# EAGLE design untitled (EAGLE 7.2.0)
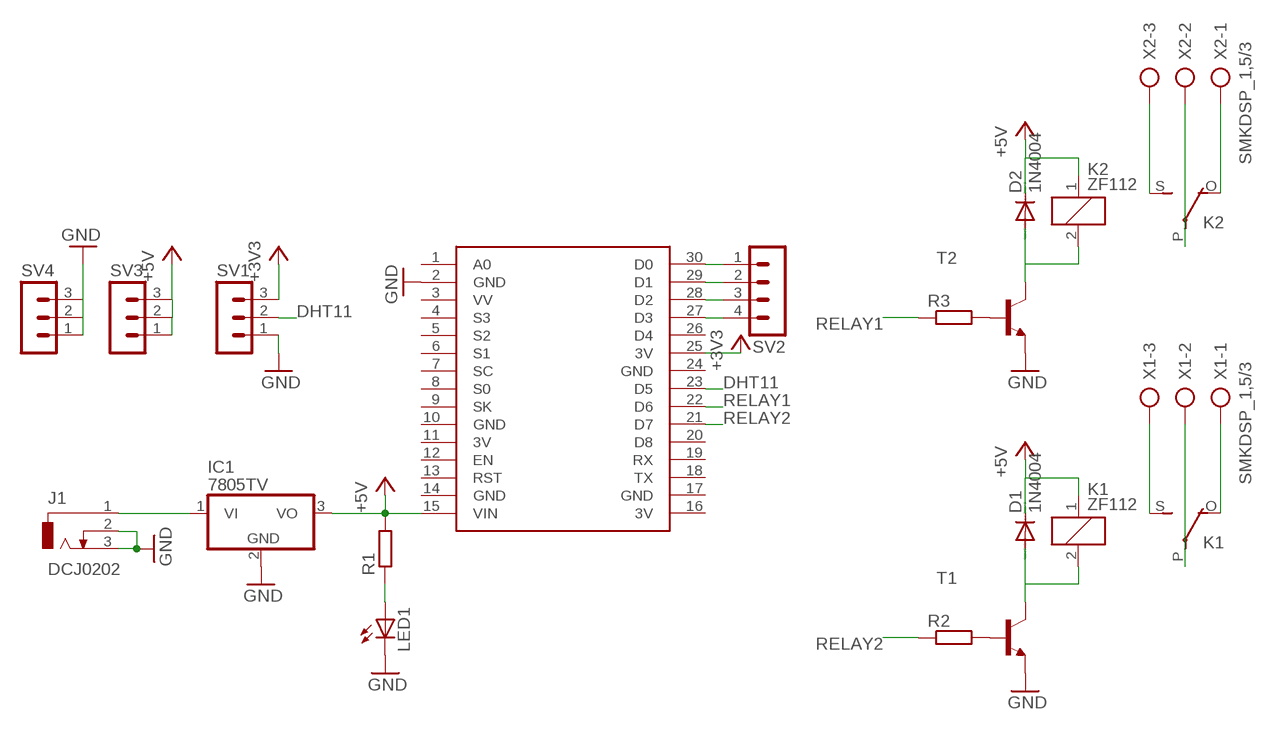
[diagram p0: schematic, sheet 1]

## Parts
D1  1N4004  [DO41-10]
D2  1N4004  [DO41-10]
IC1  7805TV  [TO220V]
J1  DCJ0202  [DCJ0202]
K1  ZF112  [ZF112]
K2  ZF112  [ZF112]
LED1  LED5MM  [LED5MM]
R1  R-EU_0207/10  [0207/10]
R2  R-EU_0207/10  [0207/10]
R3  R-EU_0207/10  [0207/10]
SV1  MA03-1  [MA03-1]
SV2  MA04-1  [MA04-1]
SV3  MA03-1  [MA03-1]
SV4  MA03-1  [MA03-1]
T1  2N2222-NPN-TO18-EBC  [TO18]
T2  2N2222-NPN-TO18-EBC  [TO18]
U$1  NODEMCU  [NODEMCU]
X1  SMKDSP_1,5/3  [SMKDSP_1,5/3]
X2  SMKDSP_1,5/3  [SMKDSP_1,5/3]

## Nets
+3V3: SV1.3 U$1.25(3V)
+5V: D1.C D2.C IC1.3(VO) K1.1 K2.1 R1.2 SV3.1 SV3.2 SV3.3 U$1.15(VIN)
DHT11: SV1.2 U$1.23(D5)
GND: IC1.2(GND) J1.2 J1.3 LED1.K(C) SV1.1 SV4.1 SV4.2 SV4.3 T1.1(E) T2.1(E) U$1.2(GND)
N$1: K1.S(2:S) X1.3
N$2: LED1.A R1.1
N$3: IC1.1(VI) J1.1
N$4: D1.A K1.2 T1.3(C)
N$5: K1.O(2:O) X1.1
N$6: SV2.1 U$1.30(D0)
N$7: SV2.2 U$1.29(D1)
N$8: SV2.3 U$1.28(D2)
N$9: SV2.4 U$1.27(D3)
N$10: K1.P(2:P) X1.2
N$11: R2.2 T1.2(B)
N$12: D2.A K2.2 T2.3(C)
N$13: R3.2 T2.2(B)
N$14: K2.S(2:S) X2.3
N$15: K2.O(2:O) X2.1
N$16: K2.P(2:P) X2.2
RELAY1: R3.1 U$1.22(D6)
RELAY2: R2.1 U$1.21(D7)
Unconnected: U$1.1(A0) U$1.3(VV) U$1.4(S3) U$1.5(S2) U$1.6(S1) U$1.7(SC) U$1.8(S0) U$1.9(SK) U$1.12(EN) U$1.13(RST) U$1.18(TX) U$1.19(RX) U$1.20(D8) U$1.26(D4)

## Power pins joined to a net without a drawn wire
3V: U$1.11(3V) U$1.16(3V)
GND: U$1.10(GND) U$1.14(GND) U$1.17(GND) U$1.24(GND)

## Library data of the parts
D1 D2 = diode:1N4004: DIODE general purpose rectifier, 1 A
IC1 = linear:78*: Positive VOLTAGE REGULATOR Source: http://cache.national.com/ds/LM/LM78L05.pdf http://www.fairchildsemi.com/ds/LM/LM7805.pdf
J1 = con-jack:DCJ0202: DC POWER JACK Source: DCJ0202.pdf; OC_FARNELL: unknown; OC_NEWARK: unknown
K1 K2 = relay:ZF112: RELAY 1 x switch; OC_FARNELL: unknown; OC_NEWARK: unknown
LED1 = led:LED: LED OSRAM: - CHIPLED LG R971, LG N971, LY N971, LG Q971, LY Q971, LO R971, LY R971 LH N974, LH R974 LS Q976, LO Q976, LY Q976 LO Q996 - Hyper CHIPLED LW Q18S LB Q993, LB Q99A, LB R99A - SideLED LS A670, LO A670, LY A670, LG A670, LP A670 LB A673, LV A673, LT A673, LW A673 LH A674 LY A675 LS A676, LA A676, LO A676, LY A676, LW A676 LS A679, LY A679, LG A679 - Hyper Micro SIDELED® LS Y876, LA Y876, LO Y876, LY Y876 LT Y87S - SmartLED LW L88C, LW L88S LB L89C, LB L89S, LG L890 LS L89K, LO L89K, LY L89K LS L896, LA L896, LO L896, LY L896 - TOPLED LS T670, LO T670, LY T670, LG T670, LP T670 LSG T670, LSP T670, LSY T670, LOP T670, LYG T670 LG T671, LOG T671, LSG T671 LB T673, LV T673, LT T673, LW T673 LH T674 LS T676, LA T676, LO T676, LY T676, LB T676, LH T676, LSB T676, LW T676 LB T67C, LV T67C, LT T67C, LS T67K, LO T67K, LY T67K, LW E67C LS E67B, LA E67B, LO E67B, LY E67B, LB E67C, LV E67C, LT E67C LW T67C LS T679, LY T679, LG T679 LS T770, LO T770, LY T770, LG T770, LP T770 LB T773, LV T773, LT T773, LW T773 LH T774 LS E675, LA E675, LY E675, LS T675 LS T776, LA T776, LO T776, LY T776, LB T776 LHGB T686 LT T68C, LB T68C - Hyper Mini TOPLED® LB M676 - Mini TOPLED Santana® LG M470 LS M47K, LO M47K, LY M47K Source: http://www.osram.convergy.de LUXEON: - LUMILED® LXK2-PW12-R00, LXK2-PW12-S00, LXK2-PW14-U00, LXK2-PW14-V00 LXK2-PM12-R00, LXK2-PM12-S00, LXK2-PM14-U00 LXK2-PE12-Q00, LXK2-PE12-R00, LXK2-PE12-S00, LXK2-PE14-T00, LXK2-PE14-U00 LXK2-PB12-K00, LXK2-PB12-L00, LXK2-PB12-M00, LXK2-PB14-N00, LXK2-PB14-P00, LXK2-PB14-Q00 LXK2-PR12-L00, LXK2-PR12-M00, LXK2-PR14-Q00, LXK2-PR14-R00 LXK2-PD12-Q00, LXK2-PD12-R00, LXK2-PD12-S00 LXK2-PH12-R00, LXK2-PH12-S00 LXK2-PL12-P00, LXK2-PL12-Q00, LXK2-PL12-R00 Source: www.luxeon.com KINGBRIGHT: KA-3528ASYC Source: www.kingbright.com
R1-R3 = resistor:R-EU_: RESISTOR, European symbol
SV1 SV3 SV4 = con-lstb:MA03-1: PIN HEADER; OC_FARNELL: unknown; OC_NEWARK: unknown
SV2 = con-lstb:MA04-1: PIN HEADER; OC_FARNELL: unknown; OC_NEWARK: unknown
T1 T2 = transistor:*-NPN-: NPN Transistror BF959 corrected 2008.03.06
U$1 = nodemcu:NODEMCU
X1 X2 = con-phoenix-smkdsp:SMKDSP_1,5/3: Printklemme, Nennstrom: 17,5 A, Bemessungsspannung: 250 V, Raster: 5,0 mm Source: http://eshop.phoenixcontact.de .. 1733415.pdf; MF: FARNELL; MPN: 1733583; OC_FARNELL: 3041256; OC_NEWARK: 71C4130

## Board
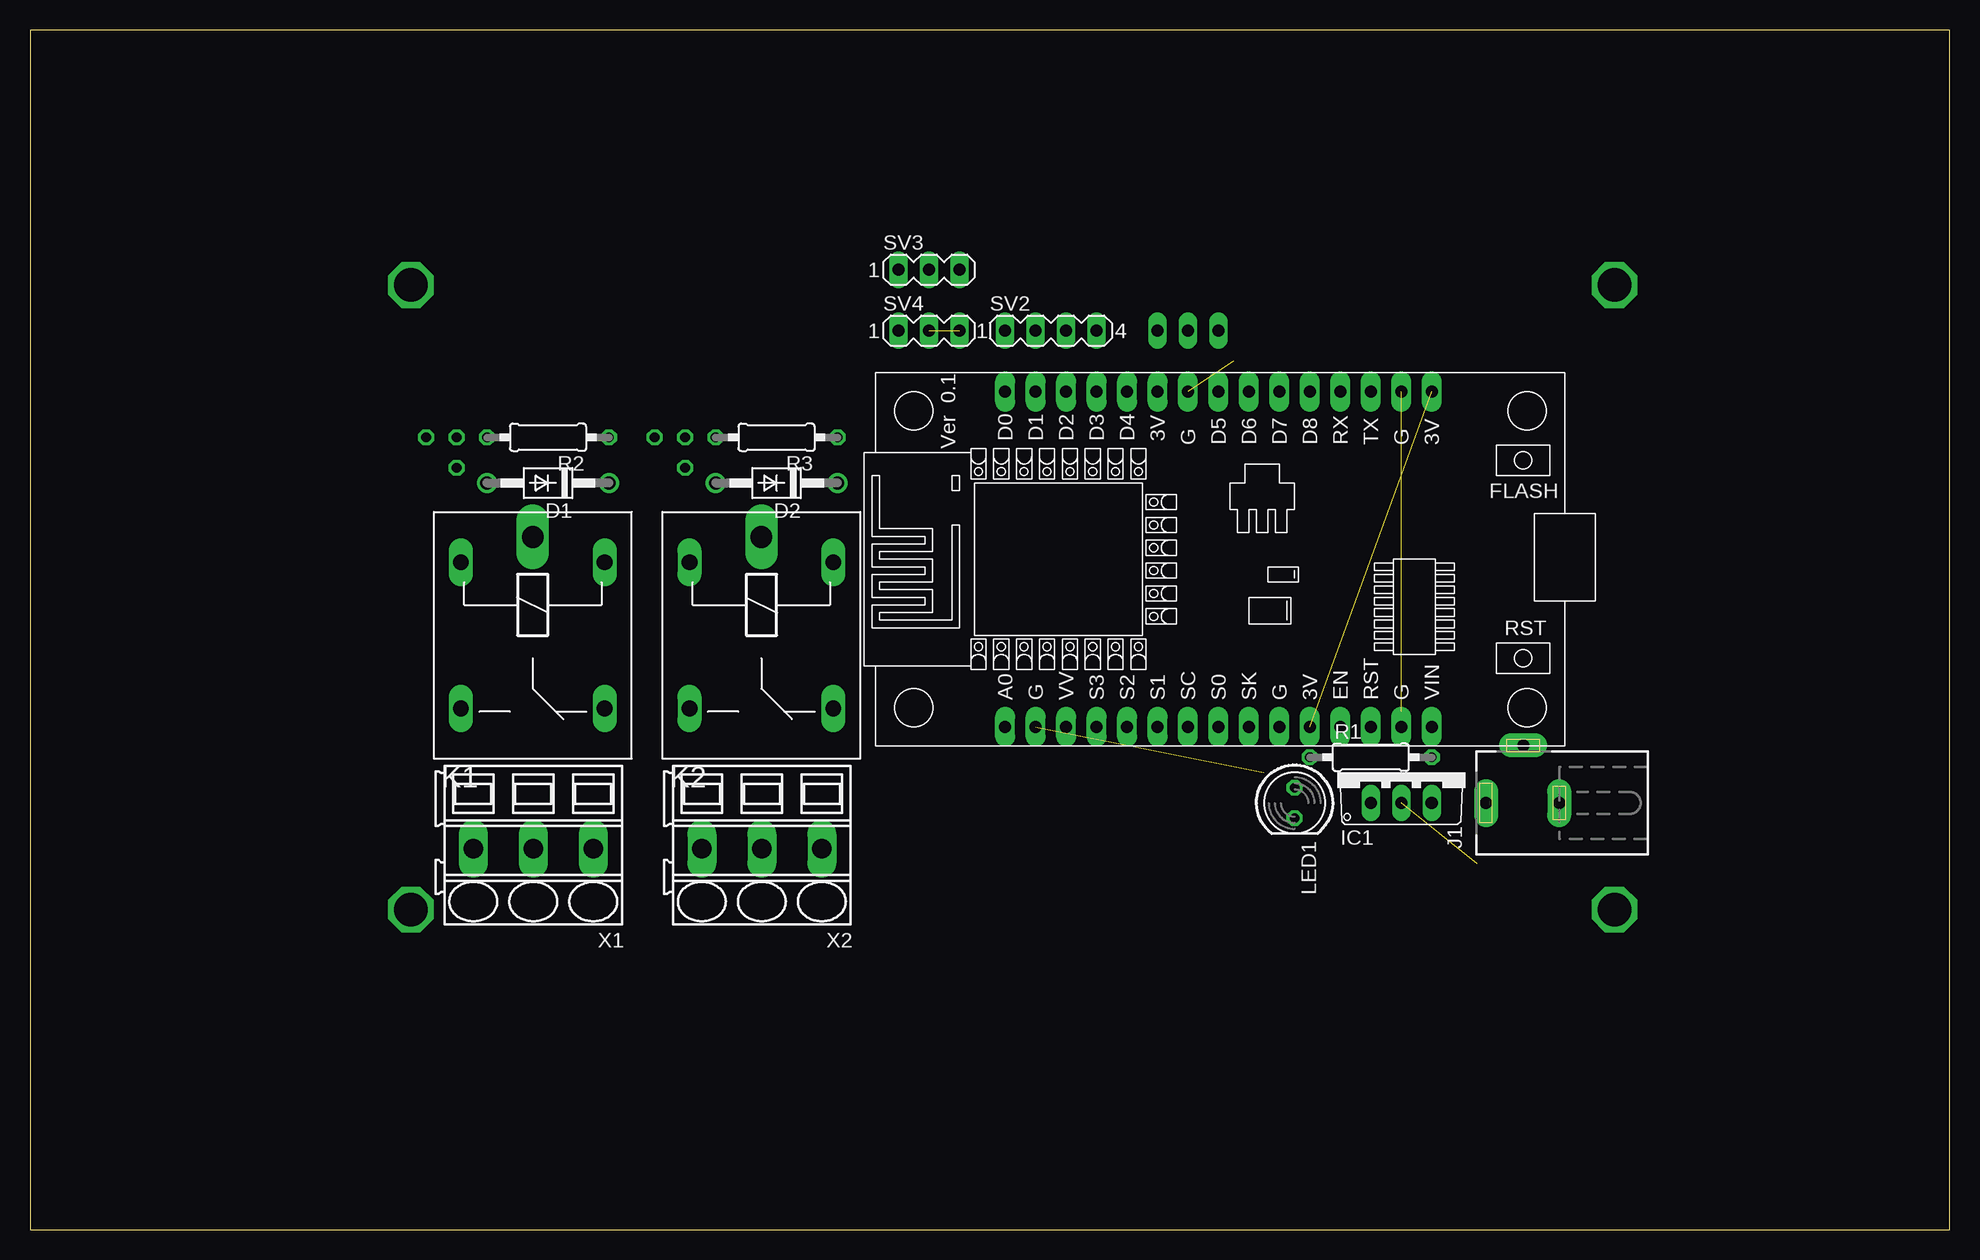
[diagram p1: board, top side]
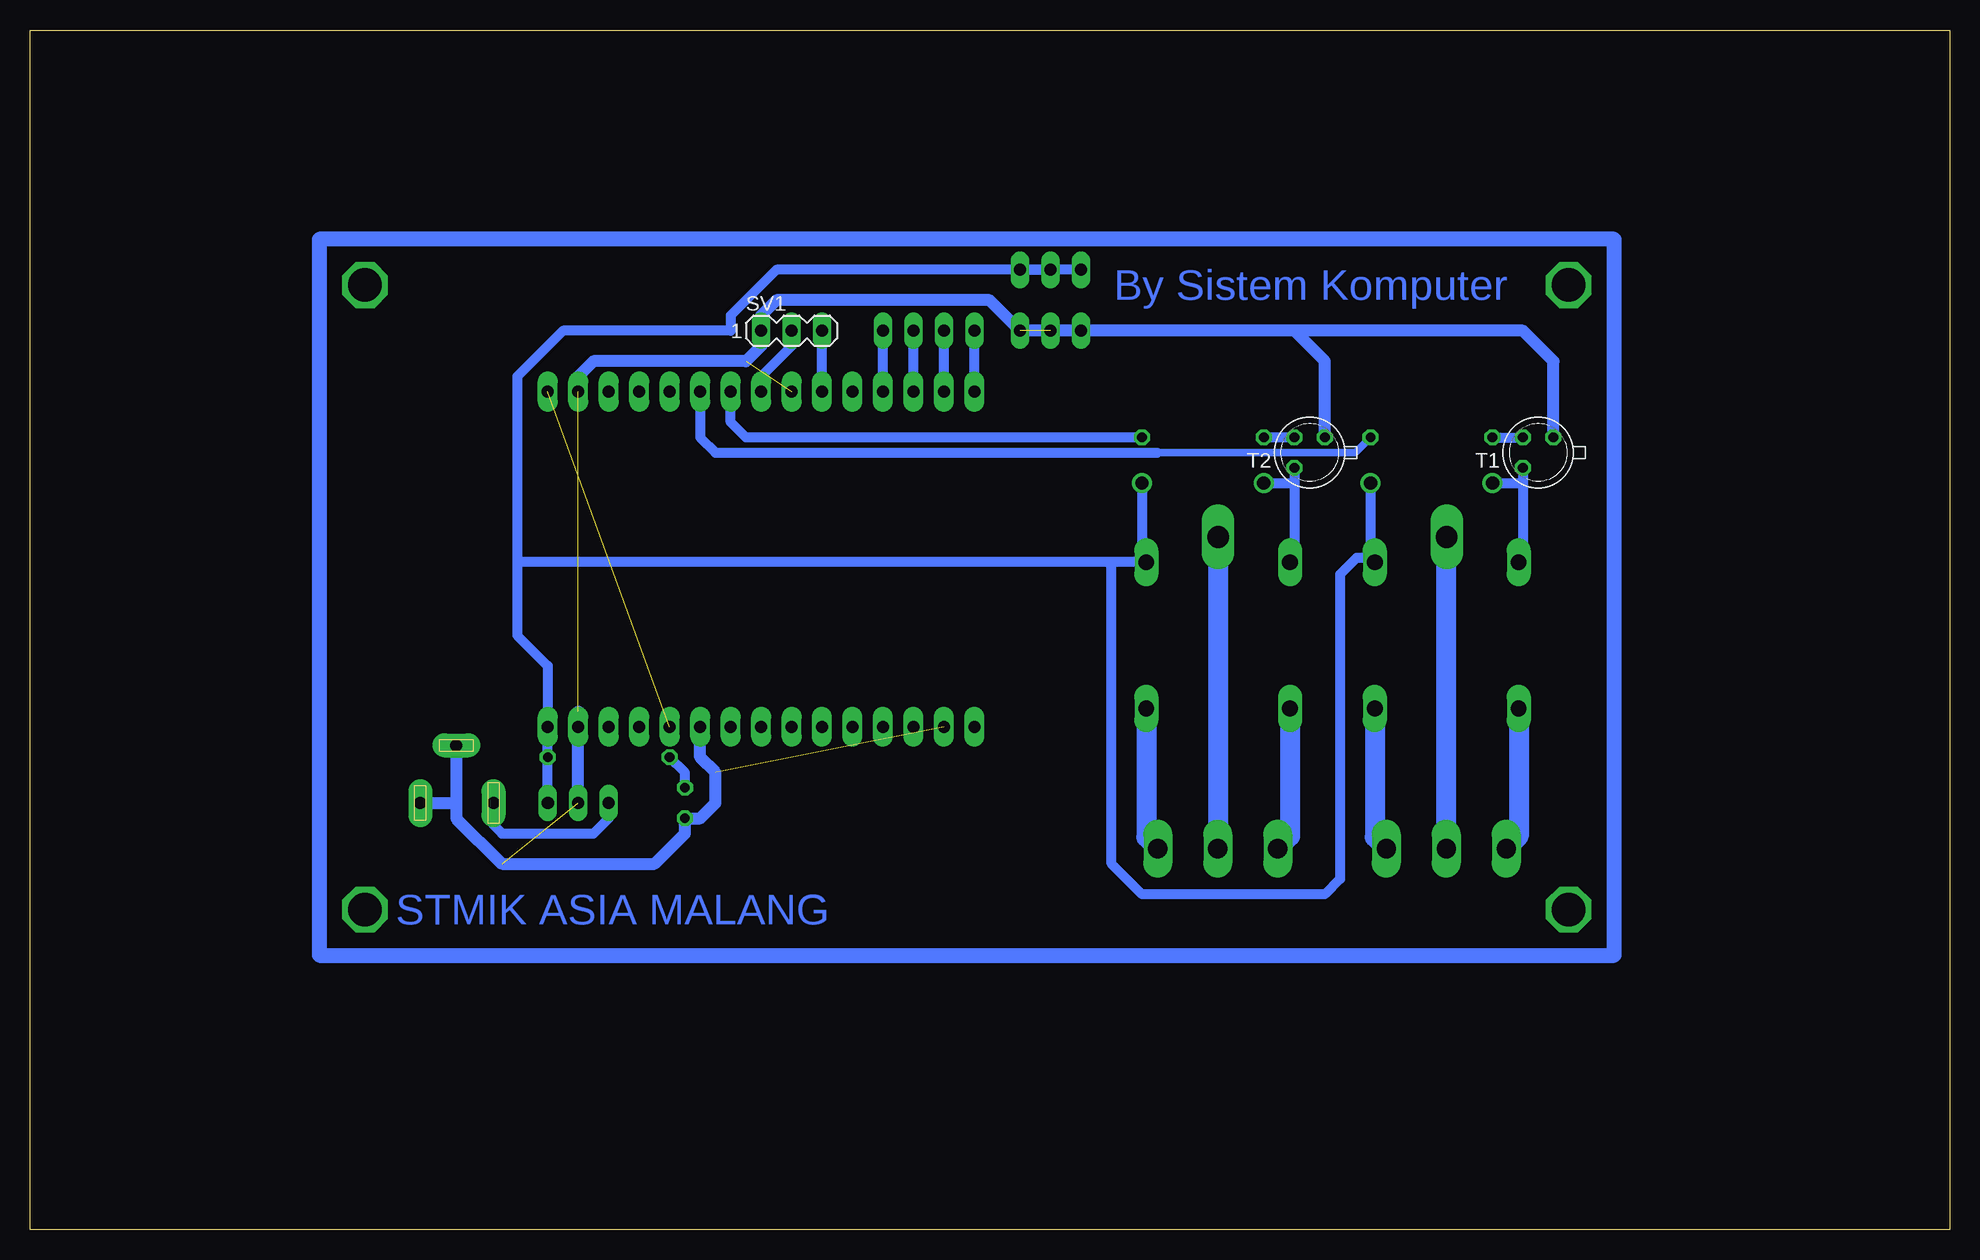
[diagram p2: board, bottom side, seen from below]

Size 160 x 100 mm. Coordinates in mm from the lower left corner, seen from the top.
Outline: 0,0 160,0 160,100 0,100 0,0
Copper layers (1*16): Top 0.035mm / dielectric 1.5mm / Bottom 0.035mm
Design rules "default": minimum track width 10mil, minimum drill 24mil, track to track 8mil, track to pad 8mil, pad to pad 8mil, via to via 8mil, smd to smd 8mil, copper to edge 40mil, drill to drill 8mil, minimum pad ring 10mil, minimum via ring 8mil, stop-mask expansion 4mil, vias tented up to drill 0mil, thermal gap 10mil

### Footprints (pad centres in the part's own frame; a part is rotated, then mirrored left to right if it is on the bottom)
DO41-10 = drill 1.118: A 5.08,0; C -5.08,0
TO220V = drill 1.016 long: 1 -2.54,-2.54; 2 0,-2.54; 3 2.54,-2.54
DCJ0202 = drill 1 pad 2 long: 1 0,3.1; 2 4.8,0; 3 0,-3
ZF112 = drill 1.321 long: 1 -6.096,5.994; 2 -6.096,-5.994; O 6.096,5.994; S 6.096,-5.994 | drill 1.803 long: P -8.204,0
LED5MM = drill 0.813 octagon: A -1.27,0; K 1.27,0
0207/10 = drill 0.813 octagon: 1 -5.08,0; 2 5.08,0
MA03-1 = drill 1.016 long: 1 -2.54,0; 2 0,0; 3 2.54,0
MA04-1 = drill 1.016 long: 1 -3.81,0; 2 -1.27,0; 3 1.27,0; 4 3.81,0
TO18 = drill 0.813 octagon: 1 -1.27,-1.27; 2 1.27,-1.27; 3 1.27,1.27
NODEMCU = drill 1 pad 1.676 long: 1 -13.97,17.78; 2 -13.97,15.24; 3 -13.97,12.7; 4 -13.97,10.16; 5 -13.97,7.62; 6 -13.97,5.08; 7 -13.97,2.54; 8 -13.97,0; 9 -13.97,-2.54; 10 -13.97,-5.08; 11 -13.97,-7.62; 12 -13.97,-10.16; 13 -13.97,-12.7; 14 -13.97,-15.24; 15 -13.97,-17.78; 16 13.97,-17.78; 17 13.97,-15.24; 18 13.97,-12.7; 19 13.97,-10.16; 20 13.97,-7.62; 21 13.97,-5.08; 22 13.97,-2.54; 23 13.97,0; 24 13.97,2.54; 25 13.97,5.08; 26 13.97,7.62; 27 13.97,10.16; 28 13.97,12.7; 29 13.97,15.24; 30 13.97,17.78
SMKDSP_1,5/3 = drill 1.6 pad 1.8 long: 1 -2.5,0; 2 2.5,0; 3 7.5,0

### Placement (x,y rotation side)
D1  43.18,62.23 180 top
D2  62.23,62.23 180 top
IC1  114.3,38.1 0 top
J1  124.46,35.56 90 top
K1  41.91,49.53 270 top
K2  60.96,49.53 270 top
LED1  105.41,35.56 270 top
R1  111.76,39.37 0 top
R2  43.18,66.04 180 top
R3  62.23,66.04 180 top
SV1  96.52,74.93 0 bottom
SV2  85.09,74.93 0 top
SV3  74.93,80.01 0 top
SV4  74.93,74.93 0 top
T1  34.29,64.77 180 bottom
T2  53.34,64.77 180 bottom
U$1  99.06,55.88 90 top
X1  44.45,31.75 180 top
X2  63.5,31.75 180 top

### Tracks (layer width: path | path; a pad name or v marks a point on that pad's centre or on a via)
3V  (1 unrouted)
+3V3
  Bottom 0.813: U$1.25 SV1.3
+5V
  Bottom 0.813: IC1.3 R1.2 U$1.15 116.84,46.99 119.38,49.53 119.38,55.88 | SV3.3 SV3.2 SV3.1 97.79,80.01 101.6,76.2 101.6,74.93 115.57,74.93 119.38,71.12 119.38,55.88 | D1.C 48.26,55.98 | 48.26,55.98 K1.1 | D2.C 67.31,55.98 K2.1 69.85,55.63 | 69.85,55.63 119.13,55.63 119.38,55.88 | 48.26,55.98 49.43,55.98 50.8,54.61 50.8,29.21 52.07,27.94 67.31,27.94 69.85,30.48 69.85,55.63
DHT11
  Bottom 0.813: U$1.23 99.06,71.12 96.52,73.66 SV1.2
GND  (5 unrouted)
  Bottom 1.016: U$1.17 114.3,71.12 113.03,72.39 100.33,72.39 99.06,73.66 SV1.1 99.06,76.2 97.79,77.47 80.01,77.47 SV4.3 SV4.1 54.61,74.93 | 114.3,43.18 U$1.14 IC1.2 | U$1.10 104.14,39.37 102.87,38.1 102.87,35.56 104.14,34.29 LED1.K 105.41,33.02 107.95,30.48 120.65,30.48 124.46,34.29 124.46,35.56 | T2.1 52.07,72.39 54.61,74.93 | T1.1 33.02,72.39 35.56,74.93 54.61,74.93 | J1.2 124.46,35.56 | J1.3 124.46,35.56
N$1
  Bottom 1.676: K1.S 35.92,32.78 X1.3
N$2
  Bottom 0.813: LED1.A 105.41,38.1 R1.1
N$3
  Bottom 0.813: J1.1 121.36,33.73 120.65,33.02 113.03,33.02 111.76,34.29 IC1.1
N$4
  Bottom 0.813: T1.3 35.56,62.23 | 35.56,62.23 35.56,55.98 K1.2 | D1.A 35.56,62.23
N$5
  Bottom 1.676: K1.O 47.9,32.7 X1.1
N$6
  Bottom 0.813: U$1.30 SV2.1
N$7
  Bottom 0.813: U$1.29 SV2.2
N$8
  Bottom 0.813: U$1.28 SV2.3
N$9
  Bottom 0.813: U$1.27 SV2.4
N$10
  Bottom 1.676: X1.2 41.95,57.69 K1.P
N$11
  Bottom 0.813: R2.2 T1.2
N$12
  Bottom 0.813: T2.3 54.61,62.23 | 54.61,62.23 54.61,55.98 K2.2 | D2.A 54.61,62.23
N$13
  Bottom 0.813: T2.2 R3.2
N$14
  Bottom 1.676: K2.S 54.97,32.78 X2.3
N$15
  Bottom 1.676: K2.O 66.95,32.7 X2.1
N$16
  Bottom 1.676: K2.P 60.96,31.79 X2.2
N$18
  Bottom 1.27: 27.94,82.55 135.89,82.55 135.89,22.86 27.94,22.86 27.94,82.55
N$19  (via drill 2.8 pad 3.81)
  other vias: 31.75,78.74
N$20  (via drill 2.8 pad 3.81)
  other vias: 132.08,78.74
N$21  (via drill 2.8 pad 3.81)
  other vias: 132.08,26.67
N$22  (via drill 2.8 pad 3.81)
  other vias: 31.75,26.67
RELAY1
  Bottom 0.813: R3.1 100.33,66.04 101.6,67.31 U$1.22
RELAY2
  Bottom 0.61: 66.04,64.77 49.53,64.77 R2.1
  Bottom 0.813: U$1.21 104.14,66.04 102.87,64.77 66.04,64.77

### Text on the board
Bottom: By Sistem Komputer | STMIK ASIA MALANG
200bmp: F:/arduino day workshop/Untitled-1.bmp